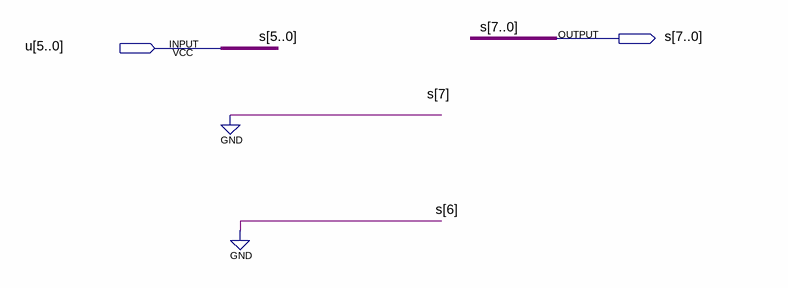
[diagram p0: schematic sheet]
// Quartus schematic zeroExtend.bdf as structural Verilog: 0 symbols, 2 pins
module zeroExtend (
  input  [5:0] u,
  output [7:0] s
);


  assign s = {2'b00, u};
endmodule
